# EAGLE design layout (EAGLE 6.2)
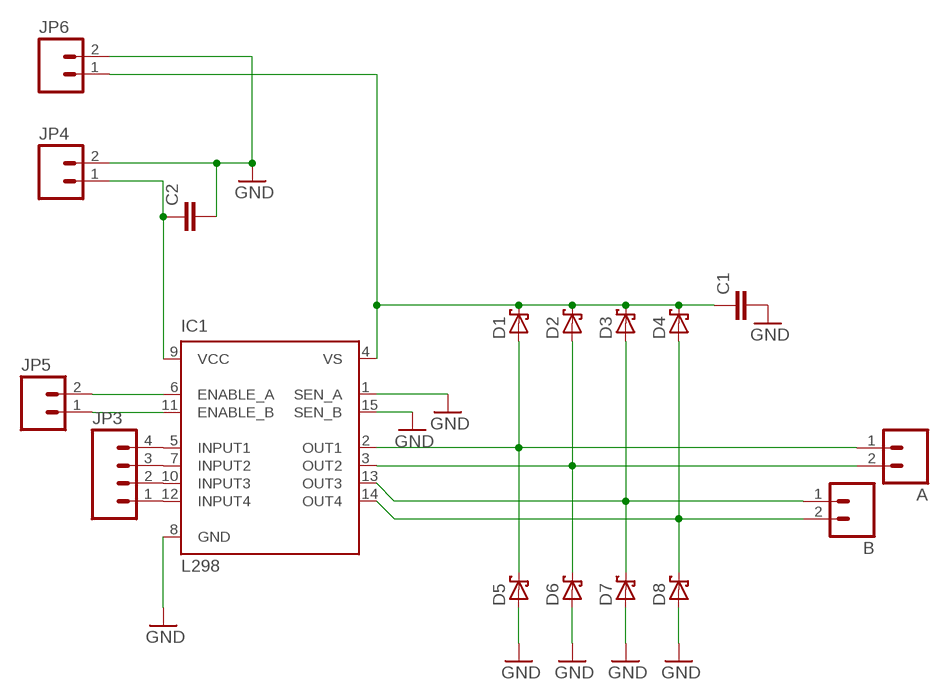
[diagram p0: schematic, sheet 1]

## Parts
A  M02PTH4  [1X02_XTRA_BIG]
B  M02PTH4  [1X02_XTRA_BIG]
C1  C2,5-3  [C2.5-3]
C2  C2,5-3  [C2.5-3]
D1  SCHOTTKY-DIODEF126Z12  [F126Z12]
D2  SCHOTTKY-DIODEF126Z12  [F126Z12]
D3  SCHOTTKY-DIODEF126Z12  [F126Z12]
D4  SCHOTTKY-DIODEF126Z12  [F126Z12]
D5  SCHOTTKY-DIODEF126Z12  [F126Z12]
D6  SCHOTTKY-DIODEF126Z12  [F126Z12]
D7  SCHOTTKY-DIODEF126Z12  [F126Z12]
D8  SCHOTTKY-DIODEF126Z12  [F126Z12]
IC1  L298  [MULTIWATT-15]
JP3  M04POLAR  [MOLEX-1X4]
JP4  M021X02_NO_SILK  [1X02_NO_SILK]
JP5  M02PTH  [1X02]
JP6  M021X02_NO_SILK  [1X02_NO_SILK]

## Nets
GND: C1.2 C2.2 D5.A D6.A D7.A D8.A IC1.1(SEN_A) IC1.8(GND) IC1.15(SEN_B) JP4.2 JP6.2
N$1: IC1.12(INPUT4) JP3.1
N$2: IC1.10(INPUT3) JP3.2
N$3: A.1 D1.A D5.C IC1.2(OUT1)
N$4: A.2 D2.A D6.C IC1.3(OUT2)
N$5: B.1 D3.A D7.C IC1.13(OUT3)
N$6: B.2 D4.A D8.C IC1.14(OUT4)
N$7: IC1.7(INPUT2) JP3.3
N$8: IC1.5(INPUT1) JP3.4
N$9: C1.1 D1.C D2.C D3.C D4.C IC1.4(VS) JP6.1
N$10: C2.1 IC1.9(VCC) JP4.1
N$11: IC1.11(ENABLE_B) JP5.1
N$12: IC1.6(ENABLE_A) JP5.2

## Library data of the parts
A B JP4-JP6 = SparkFun-Connectors:M02: Header 2 Standard 2-pin 0.1" header. Use with straight break away headers (SKU : PRT-00116), right angle break away headers (PRT-00553), swiss pins (PRT-00743), machine pins (PRT-00117), and female headers (PRT-00115). Molex polarized connector foot print use with SKU : PRT-08233 with associated crimp pins and housings.
C1 C2 = capacitor-wima:C: CAPACITOR naming: grid - package width
D1-D8 = diode:SCHOTTKY-DIODE: Schottky Diode
IC1 = st-microelectronics:L298: DUAL FULL-BRIDGE DRIVER; MPN: L298N; OC_FARNELL: 1589425; OC_NEWARK: 32M1527
JP3 = SparkFun-Connectors:M04: Header 4 Standard 4-pin 0.1" header. Use with straight break away headers (SKU : PRT-00116), right angle break away headers (PRT-00553), swiss pins (PRT-00743), machine pins (PRT-00117), and female headers (PRT-00115). Molex polarized connector foot print use with SKU : PRT-08231 with associated crimp pins and housings. 1MM SMD Version SKU: PRT-10208

## Board
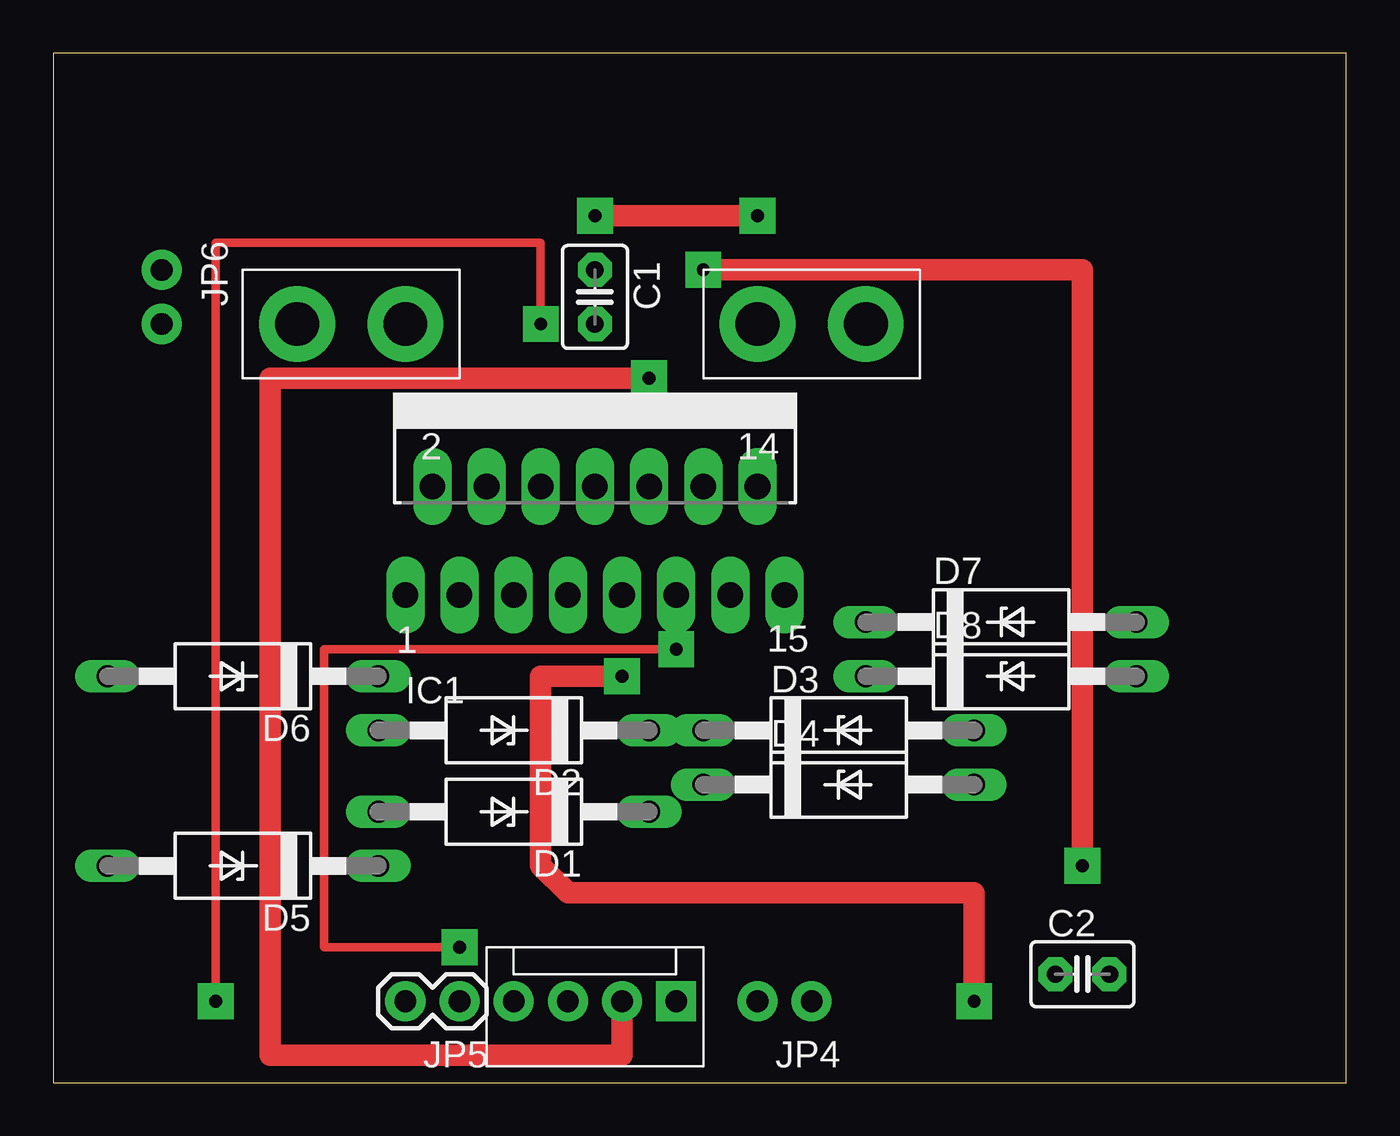
[diagram p1: board, top side]
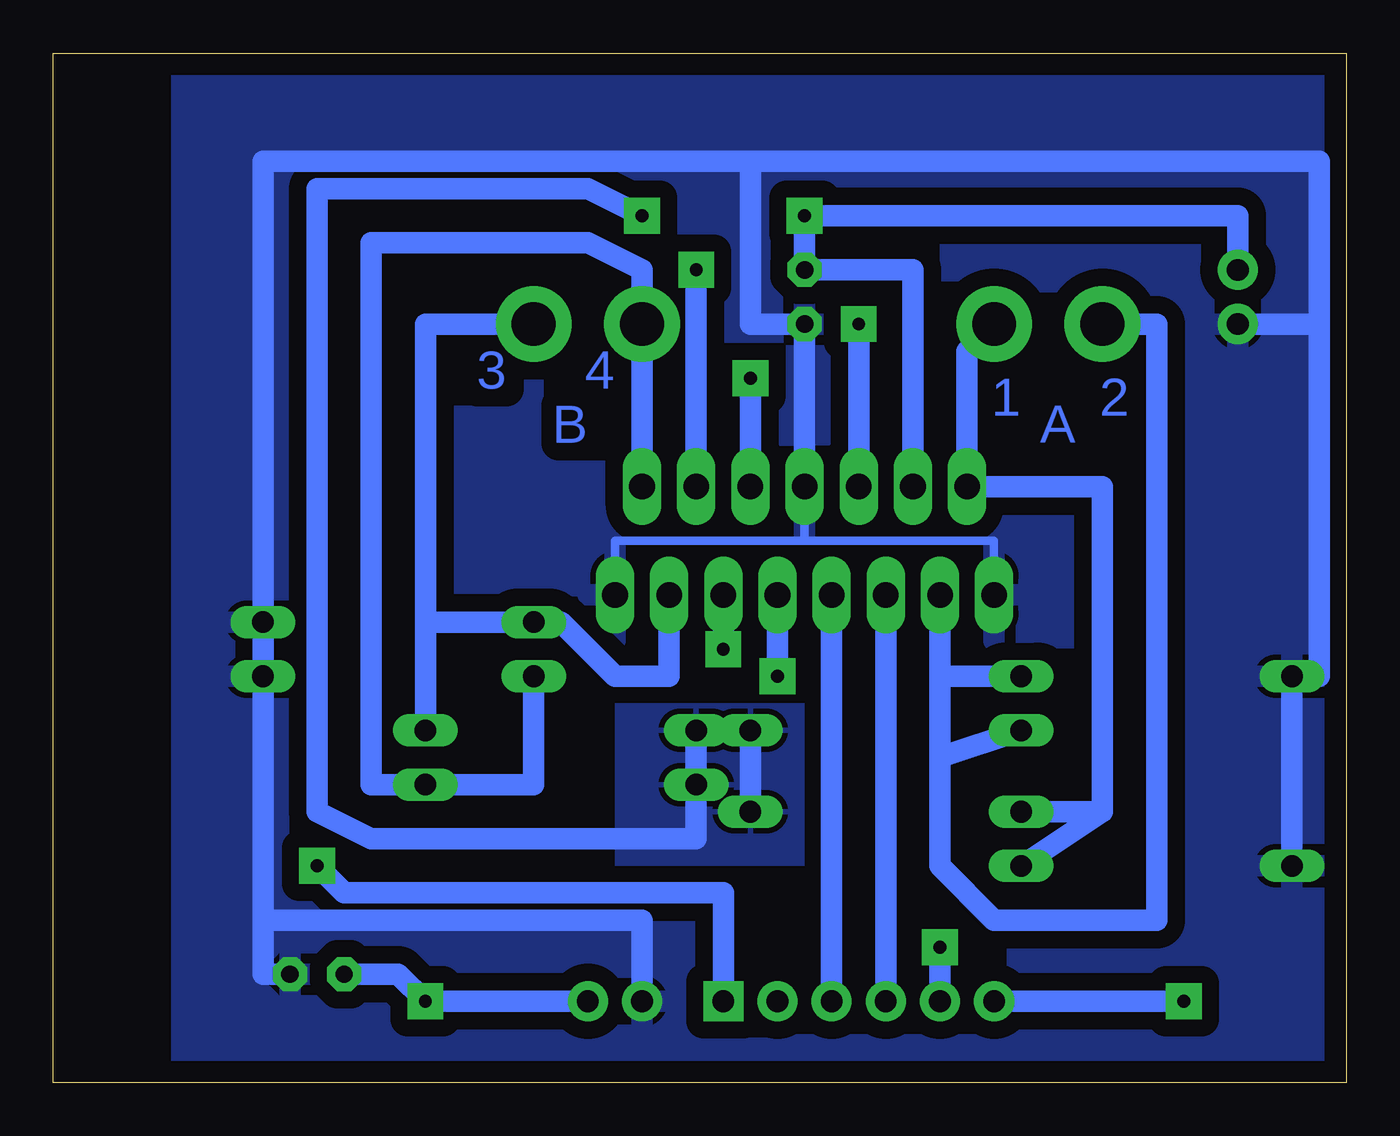
[diagram p2: board, bottom side, seen from below]

Size 60.63 x 48.25 mm. Coordinates in mm from the lower left corner, seen from the top.
Outline: 0,0 60.63,0 60.63,48.25 0,48.25 0,0
Copper layers (1*16): Top 0.035mm / dielectric 1.5mm / Bottom 0.035mm
Design rules: minimum track width 10mil, minimum drill 24mil, track to track 8mil, track to pad 8mil, pad to pad 8mil, via to via 8mil, smd to smd 8mil, copper to edge 40mil, drill to drill 8mil, minimum pad ring 10mil, minimum via ring 8mil, stop-mask expansion 4mil, vias tented up to drill 0mil, thermal gap 10mil

### Footprints (pad centres in the part's own frame; a part is rotated, then mirrored left to right if it is on the bottom)
1X02_XTRA_BIG = drill 2.057 pad 3.556: 1 -2.54,0; 2 2.54,0
C2.5-3 = drill 0.813 pad 1.6 octagon: 1 -1.27,0; 2 1.27,0
F126Z12 = drill 1.016 long: A 6.35,0; C -6.35,0
MULTIWATT-15 = drill 1.2 long: 1 -8.89,-7.62; 2 -7.62,-2.54; 3 -6.35,-7.62; 4 -5.08,-2.54; 5 -3.81,-7.62; 6 -2.54,-2.54; 7 -1.27,-7.62; 8 0,-2.54; 9 1.27,-7.62; 10 2.54,-2.54; 11 3.81,-7.62; 12 5.08,-2.54; 13 6.35,-7.62; 14 7.62,-2.54; 15 8.89,-7.62
MOLEX-1X4 = drill 1.016 pad 1.88 square: 1 0,0 | drill 1.016 pad 1.88: 2 2.54,0; 3 5.08,0; 4 7.62,0
1X02_NO_SILK = drill 1.016 pad 1.88: 1 0,0; 2 2.54,0
1X02 = drill 1.016 pad 1.88: 1 0,0; 2 2.54,0

### Placement (x,y rotation side)
A  13.97,35.56 180 top
B  35.56,35.56 180 top
C1  25.4,36.83 270 top
C2  48.26,5.08 0 top
D1  21.59,12.7 180 top
D2  21.59,16.51 180 top
D3  36.83,16.51 0 top
D4  36.83,13.97 0 top
D5  8.89,10.16 180 top
D6  8.89,19.05 180 top
D7  44.45,21.59 0 top
D8  44.45,19.05 0 top
IC1  25.4,30.48 0 top
JP3  29.21,3.81 180 top
JP4  35.56,3.81 180 top
JP5  19.05,3.81 180 top
JP6  5.08,38.1 270 top

### Tracks (layer width: path | path; a pad name or v marks a point on that pad's centre or on a via)
GND
  Bottom 0.406: IC1.15 34.29,25.4 25.4,25.4 | 25.4,25.4 IC1.8 | IC1.1 16.51,25.4 25.4,25.4
  Bottom 1.016: IC1.8 C1.2 27.94,35.56 27.94,43.18 | 27.94,43.18 50.8,43.18 D7.A D8.A 50.8,7.62 | D5.A D6.A 1.27,19.05 1.27,35.56 | 1.27,35.56 1.27,43.18 27.94,43.18 | JP4.2 33.02,7.62 50.8,7.62 | C2.2 50.8,5.08 50.8,7.62 | JP6.2 1.27,35.56
  pour Bottom (isolate 0.813): 0,48.26 0,0 54.61,0 54.61,48.26
N$1  (via drill 0.6 pad 1.68)
  Top 1.016: v48.26,10.16 48.26,38.1 v30.48,38.1
  Bottom 1.016: JP3.1 29.21,8.89 46.99,8.89 v48.26,10.16 | v30.48,38.1 IC1.12
N$2  (via drill 0.6, 0.6 pad 1.68)
  Top 1.016: JP3.2 26.67,1.27 10.16,1.27 10.16,33.02 v27.94,33.02
  Bottom 1.016: v27.94,33.02 IC1.10
  other vias: 26.67,3.81
N$3
  Bottom 1.016: A.1 17.78,34.29 IC1.2 11.43,27.94 11.43,12.7 | D5.C 11.43,12.7 | D1.A 11.43,12.7
N$4
  Bottom 1.016: 19.05,15.24 IC1.3 19.05,19.05 D6.C | 19.05,15.24 19.05,10.16 16.51,7.62 8.89,7.62 8.89,35.56 A.2 | D2.A 19.05,15.24
N$5
  Bottom 1.016: B.1 43.18,35.56 43.18,21.59 | 43.18,21.59 D7.C 36.83,21.59 34.29,19.05 31.75,19.05 IC1.13 | D3.A 43.18,21.59
N$6
  Bottom 1.016: IC1.14 B.2 33.02,38.1 35.56,39.37 45.72,39.37 45.72,13.97 D4.A 38.1,13.97 D8.C
N$7
  Bottom 1.016: IC1.7 JP3.3
N$8
  Bottom 1.016: IC1.5 JP3.4
N$9  (via drill 0.6 pad 1.68)
  Top 1.016: v33.02,40.64 v25.4,40.64
  Bottom 1.016: D3.C D4.C | D1.C D2.C D3.C | IC1.4 20.32,38.1 C1.1 v25.4,40.64 5.08,40.64 JP6.1 | D3.C 30.48,11.43 45.72,11.43 48.26,12.7 48.26,41.91 35.56,41.91 v33.02,40.64
  pour Bottom: 25.4,17.78 25.4,10.16 34.29,10.16 34.29,17.78
N$10  (via drill 0.6 pad 1.68)
  Top 1.016: v43.18,3.81 43.18,8.89 24.13,8.89 22.86,10.16 22.86,19.05 v26.67,19.05
  Bottom 1.016: JP4.1 v43.18,3.81 44.45,5.08 C2.1 | v26.67,19.05 IC1.9
N$11  (via drill 0.6 pad 1.68)
  Top 0.406: v19.05,6.35 12.7,6.35 12.7,20.32 v29.21,20.32
  Bottom 1.016: JP5.1 v19.05,6.35 | v29.21,20.32 IC1.11
N$12  (via drill 0.6 pad 1.68)
  Top 0.406: v22.86,35.56 22.86,39.37 7.62,39.37 v7.62,3.81
  Bottom 1.016: IC1.6 v22.86,35.56 | v7.62,3.81 JP5.2

### Text on the board
Bottom: 4 | 3 | 2 | 1 | A | B